# Altium project petroskey.PrjPcb
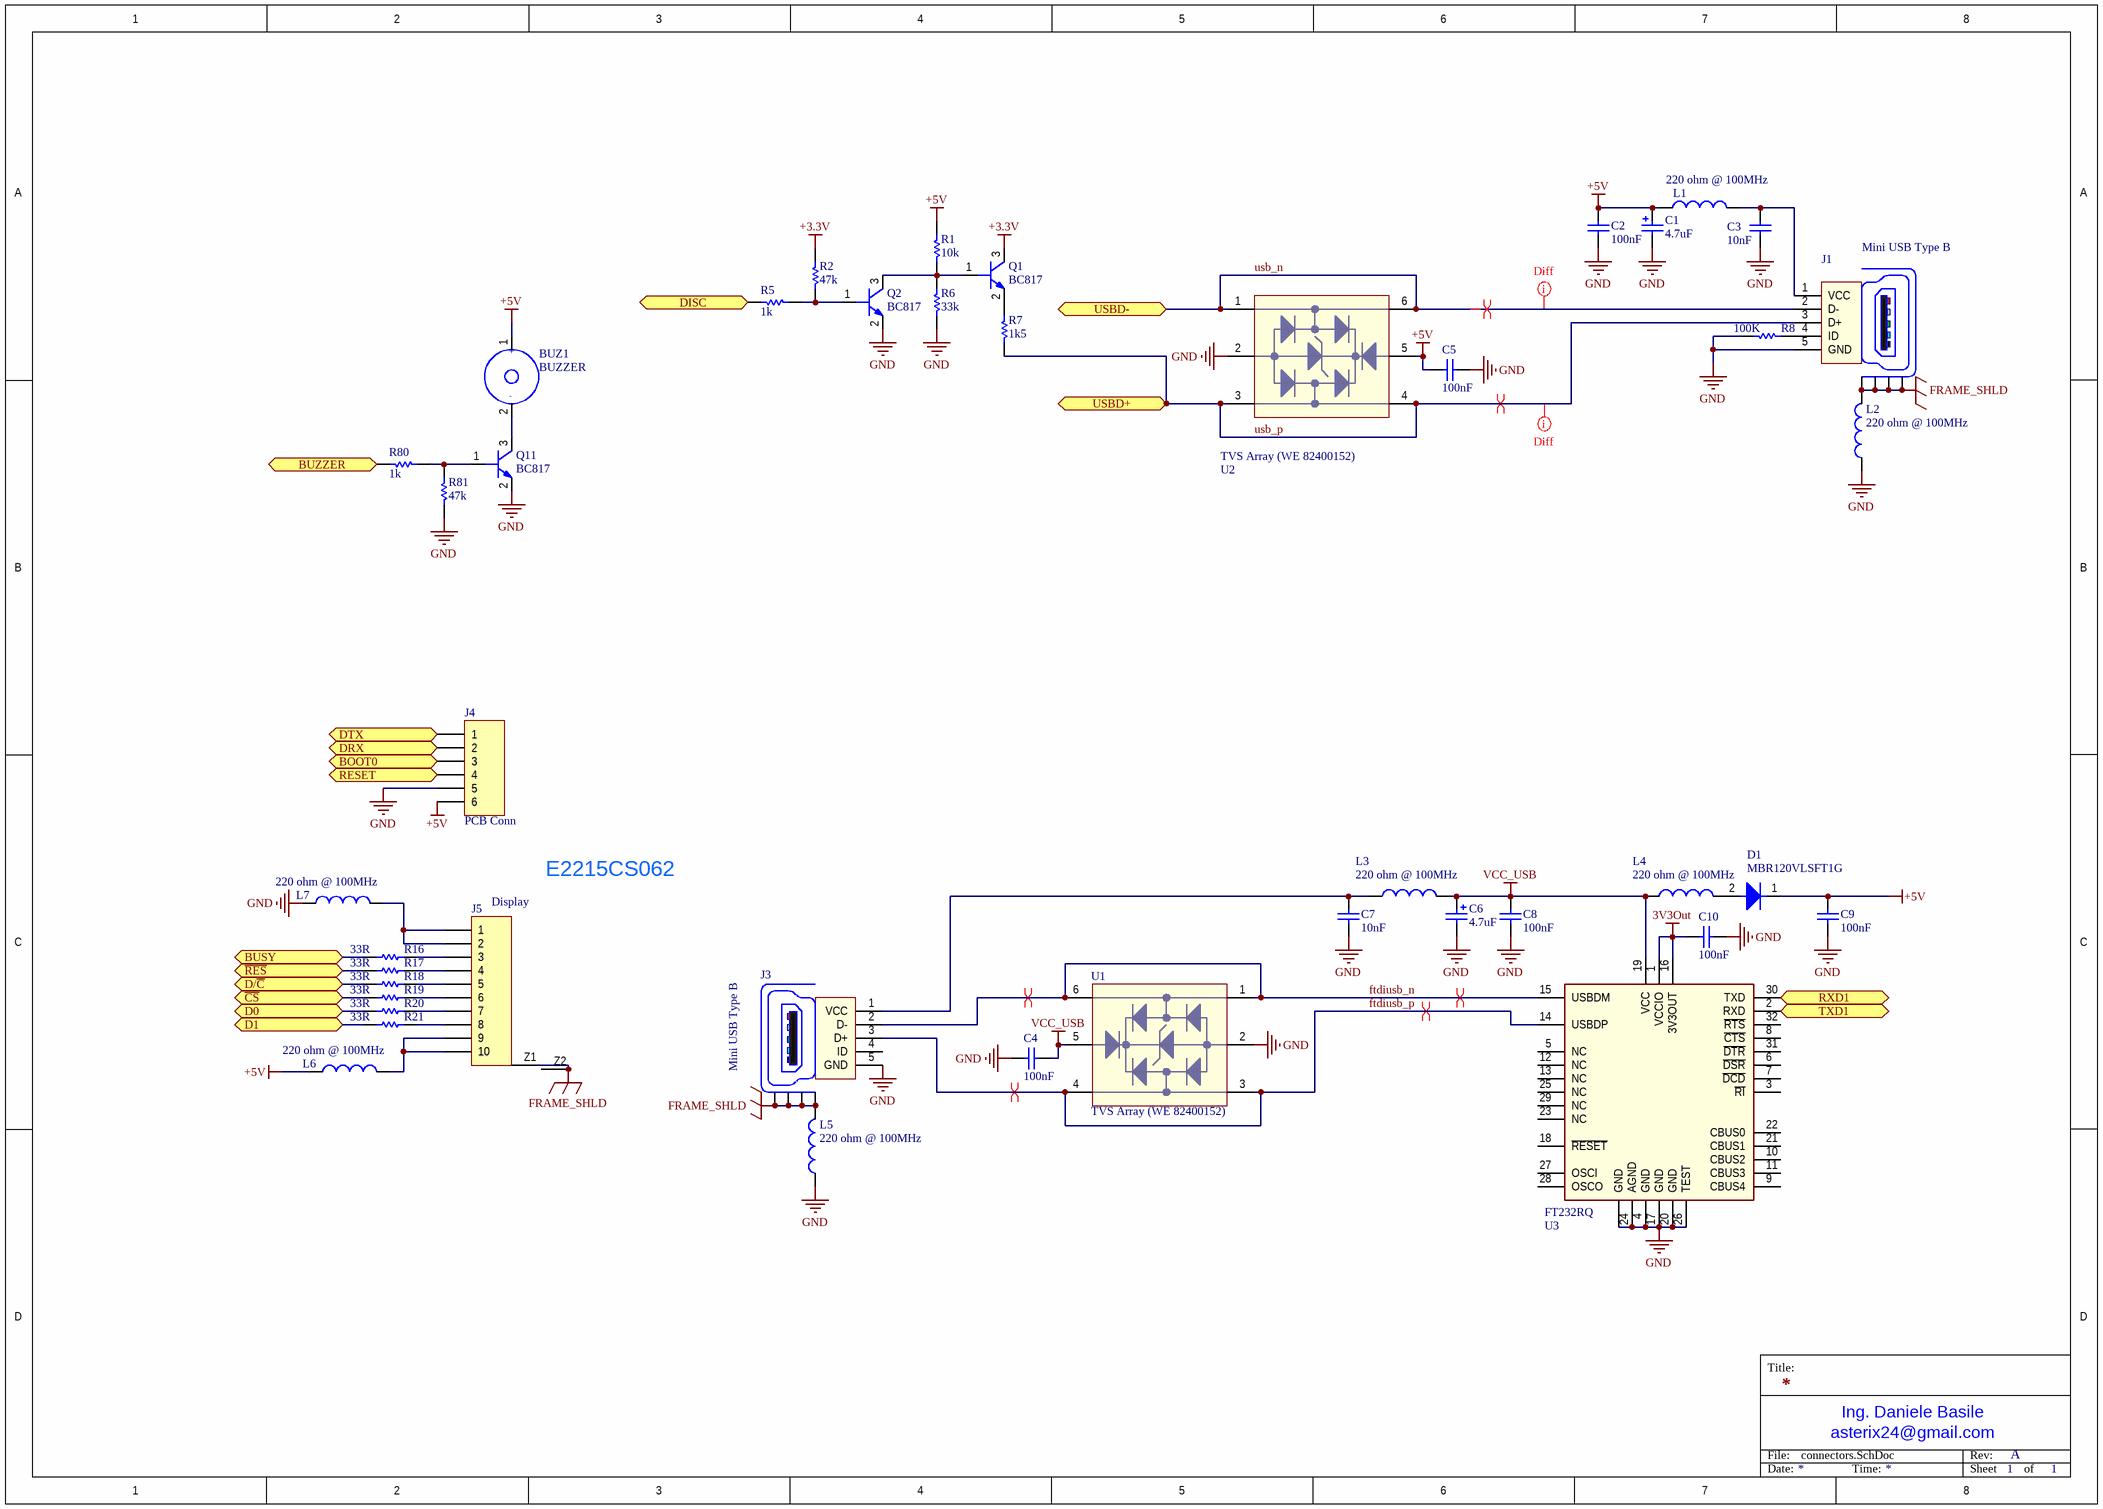
[diagram p0: connectors.SchDoc]
4 sheets, 381 parts. Net scope: flat (ports and power ports of the same name join across sheets).
Board file: petroskey.PcbDoc
Sheets:
  connectors.SchDoc
  cpu.SchDoc
  led.SchDoc
  keymap.SchDoc

## Sheet connectors.SchDoc
size A3; Organization: Develer s.r.l.; Address1: via Mugellese 1/A; Address2: 50019 Campi Bisenzio; Address3: Firenze; Address4: ITALY; Revision: A; SheetNumber: 1; SheetTotal: 1

### Parts
BUZ1  BUZZER  [buzzer_14mm_thd]
C1  4.7uF  [1206_[3216]]
C2  100nF  [0603_[1608]]
C3  10nF  [0603_[1608]]
C4  100nF  [0603_[1608]]
C5  100nF  [0603_[1608]]
C6  4.7uF  [1206_[3216]]
C7  10nF  [0603_[1608]]
C8  100nF  [0603_[1608]]
C9  100nF  [0603_[1608]]
C10  100nF  [0603_[1608]]
D1  MBR120VLSFT1G  [SOD-123]
J1  Mini USB Type B  [usb_typeB_mini_smd]
J3  Mini USB Type B  [usb_typeB_mini_smd]
J4  PCB Conn  [HEADER_1X6_2.54MM_THD]
J5  Display  [fcc-zif_10pin_0.5mm]
L1  220 ohm @ 100MHz  [0805_[2012]]
L2  220 ohm @ 100MHz  [0805_[2012]]
L3  220 ohm @ 100MHz  [0805_[2012]]
L4  220 ohm @ 100MHz  [0805_[2012]]
L5  220 ohm @ 100MHz  [0805_[2012]]
L6  220 ohm @ 100MHz  [0805_[2012]]
L7  220 ohm @ 100MHz  [0805_[2012]]
Q1  BC817  [SOT-23]
Q2  BC817  [SOT-23]
Q11  BC817  [SOT-23]
R1  10k  [0603_[1608]]
R2  47k  [0603_[1608]]
R5  1k  [0603_[1608]]
R6  33k  [0603_[1608]]
R7  1k5  [0603_[1608]]
R8  100K  [0603_[1608]]
R16  33R  [0603_[1608]]
R17  33R  [0603_[1608]]
R18  33R  [0603_[1608]]
R19  33R  [0603_[1608]]
R20  33R  [0603_[1608]]
R21  33R  [0603_[1608]]
R80  1k  [0603_[1608]]
R81  47k  [0603_[1608]]
U1  TVS Array (WE 82400152)  [SOT-563]
U2  TVS Array (WE 82400152)  [SOT-563]
U3  FT232RQ  [QFN-32]

### Ports
BOOT0, BUSY, BUZZER, D0, D1, D/~{C}, DISC, DRX, DTX, RESET, RXD1, TXD1, USBD+, USBD-, ~{CS}, ~{RES}

### Nets
3V3Out: C10.1 U3.1(VCCIO) U3.16(3V3OUT)
+3.3V: Q1.3(C) R2.1
+5V: BUZ1.1 C1.1 C2.1 C5.2 C9.2 D1.1(K) J4.6 L1.1 L6.1 R1.1 U2.5
FRAME_SHLD: J1.Z1(Shield) J1.Z2(Shield) J1.Z3(Shield) J1.Z4(Shield) J3.Z1(Shield) J3.Z2(Shield) J3.Z3(Shield) J3.Z4(Shield) J5.Z1 J5.Z2 L2.2 L5.2
GND: C1.2 C2.2 C3.2 C4.1 C5.1 C6.2 C7.2 C8.2 C9.1 C10.2 J1.5(GND) J3.5(GND) J4.5 L2.1 L5.1 L7.1 Q2.2(E) Q11.2(E) R6.2 R8.2 R81.2 U1.2 U2.2 U3.4(GND) U3.17(GND) U3.20(GND) U3.24(AGND) U3.26(TEST) U3.GND_PAD(GND)
VCC_USB: C4.2 C6.1 C8.1 L3.1 L4.2 U1.5 U3.19(VCC)
ftdiusb_n: J3.2(D-) U1.1 U1.6 U3.15(USBDM)
ftdiusb_p: J3.3(D+) U1.3 U1.4 U3.14(USBDP)
usb_n: J1.2(D-) U2.1 U2.6 ; port USBD-
usb_p: J1.3(D+) R7.2 U2.3 U2.4 ; port USBD+
NetBUZ1_2: BUZ1.2 Q11.3(C)
NetC3_1: C3.1 J1.1(VCC) L1.2
NetC7_1: C7.1 J3.1(VCC) L3.2
NetD1_2: D1.2(A) L4.1
NetJ1_4: J1.4(ID) R8.1
NetJ4_1: J4.1 ; port DTX
NetJ4_2: J4.2 ; port DRX
NetJ4_3: J4.3 ; port BOOT0
NetJ4_4: J4.4 ; port RESET
NetJ5_1: J5.1 J5.2 L7.2
NetJ5_3: J5.3 R16.1
NetJ5_4: J5.4 R17.1
NetJ5_5: J5.5 R18.1
NetJ5_6: J5.6 R19.1
NetJ5_7: J5.7 R20.1
NetJ5_8: J5.8 R21.1
NetJ5_9: J5.9 J5.10 L6.2
NetQ1_1: Q1.1(B) Q2.3(C) R1.2 R6.1
NetQ1_2: Q1.2(E) R7.1
NetQ2_1: Q2.1(B) R2.2 R5.1
NetQ11_1: Q11.1(B) R80.1 R81.1
NetR5_2: R5.2 ; port DISC
NetR12_2: U3.2(RXD) ; port TXD1
NetR13_2: U3.30(TXD) ; port RXD1
NetR16_2: R16.2 ; port BUSY
NetR17_2: R17.2 ; port ~{RES}
NetR18_2: R18.2 ; port D/~{C}
NetR19_2: R19.2 ; port ~{CS}
NetR20_2: R20.2 ; port D0
NetR21_2: R21.2 ; port D1
NetR80_2: R80.2 ; port BUZZER

Not connected (* = marked no-connect by the designer): J3 4(ID); U3 3(~{RI}) 5(NC) 6(~{DSR}) 7(~{DCD}) 8(~{CTS}) 9(CBUS4) 10(CBUS2) 11(CBUS3) 12(NC) 13(NC) 18(~{RESET}) 21(CBUS1) 22(CBUS0) 23(NC) 25(NC) 27(OSCI) 28(OSCO) 29(NC) 31(~{DTR}) 32(~{RTS})

### Layout directives
net class usb_diff: usb_n, usb_p
differential pair: ftdiusb_n, ftdiusb_p, usb_n, usb_p

### Notes on the sheet
- (near J5) E2215CS062
- Title:
- File:
- asterix24@gmail.com
- Ing. Daniele Basile
- Rev:
- Date:
- Time:
- Sheet
- of
- (in symbol BUZZER) +; -

### Library data of the parts
C1 = Cap Pol1: Ceramic X7R 16V; Value: 10uF; Published: 8-Jun-2000; Revision: July-2002: Re-released for DXP Platform.; Publisher: Altium Limited
C2 C8-C10 = Cap: Ceramic X7R 50V; Value: 10nF; Published: 8-Jun-2000; Revision: July-2002: Re-released for DXP Platform.; Publisher: Altium Limited
C3 C7 = Cap: Ceramic X7R 50V; Published: 8-Jun-2000; Revision: July-2002: Re-released for DXP Platform.; Publisher: Altium Limited; Value: 10nF
C4 C5 = Cap: Ceramic X7R 50V; Value: 100pF; Published: 8-Jun-2000; LatestRevisionDate: 17-Jul-2002; LatestRevisionNote: Re-released for DXP Platform.; PackageReference: RAD-0.3; Publisher: Altium Limited; PackageDescription: Radial Cap, Thru-Hole; 2 Leads; 0.3 in Pin Spacing
C6 = Cap Pol1: Ceramic X5R 25V; Value: 10uF; Published: 8-Jun-2000; Revision: July-2002: Re-released for DXP Platform.; Publisher: Altium Limited
D1 = Diode: Diode Schottky  low Vf, If 1A (PMEG3010ER; MBRX120LF)
J1 = USB_Con_Type_B_mini_SMT: Mini USB SMT Type B 5 Contacts; Manufacturer: Würth Elektronik eiSos GmbH; partNo: 65100516121; ComponentLink1 Description: Manufacturer; ComponentLink2 Description: Datasheet; NoPins: 5; ComponentLink1URL: http://www.we-online.de; ComponentLink2URL: http://katalog.we-online.de/em/datasheet/65100516121.pdf; Created by: Karrer Zheng; Created Date: 10/10/2014
J3 = USB_Con_Type_B_mini_SMT: Mini USB SMT Type B 5 Contacts (WE 65100516121); Manufacturer: Würth Elektronik eiSos GmbH; ComponentLink1 Description: Manufacturer; ComponentLink2 Description: Datasheet; NoPins: 5; ComponentLink1URL: http://www.we-online.de; ComponentLink2URL: http://katalog.we-online.de/em/datasheet/65100516121.pdf; Created by: Karrer Zheng; Created Date: 10/10/2014; partNo: 65100516121
J4 = Header 6: Pin Header, 1x6, 2.54mm.; LatestRevisionDate: 17-Jul-2002; LatestRevisionNote: Re-released for DXP Platform.; Publisher: Altium Limited
J5 = Header 10: LatestRevisionDate: 17-Jul-2002; LatestRevisionNote: Re-released for DXP Platform.; Publisher: Altium Limited
L1-L7 = Inductor: WE 742792022
Q1 Q2 Q11 = BC817: BJT NPN
R1 R2 R6 R7 R16-R21 R81 = Res1: Resistor; Value: 1K; Published: 8-Jun-2000; Revision: July-2002: Re-released for DXP Platform.; Publisher: Altium Limited
R5 R80 = Res1: Resistor; Published: 8-Jun-2000; Revision: July-2002: Re-released for DXP Platform.; Publisher: Altium Limited; Value: 1K
R8 = Resistor_ST: Resistor; Value: 10K
U1 U2 = TVS_Diode_Array
U3 = FT232RQ: Serial TTL 232 <-> USB (QFN-32)

## Sheet cpu.SchDoc
size A3; Organization: Develer s.r.l.; Address1: via Mugellese 1/A; Address2: 50019 Campi Bisenzio; Address3: Firenze; Address4: ITALY; Revision: A; SheetNumber: 1; SheetTotal: 1
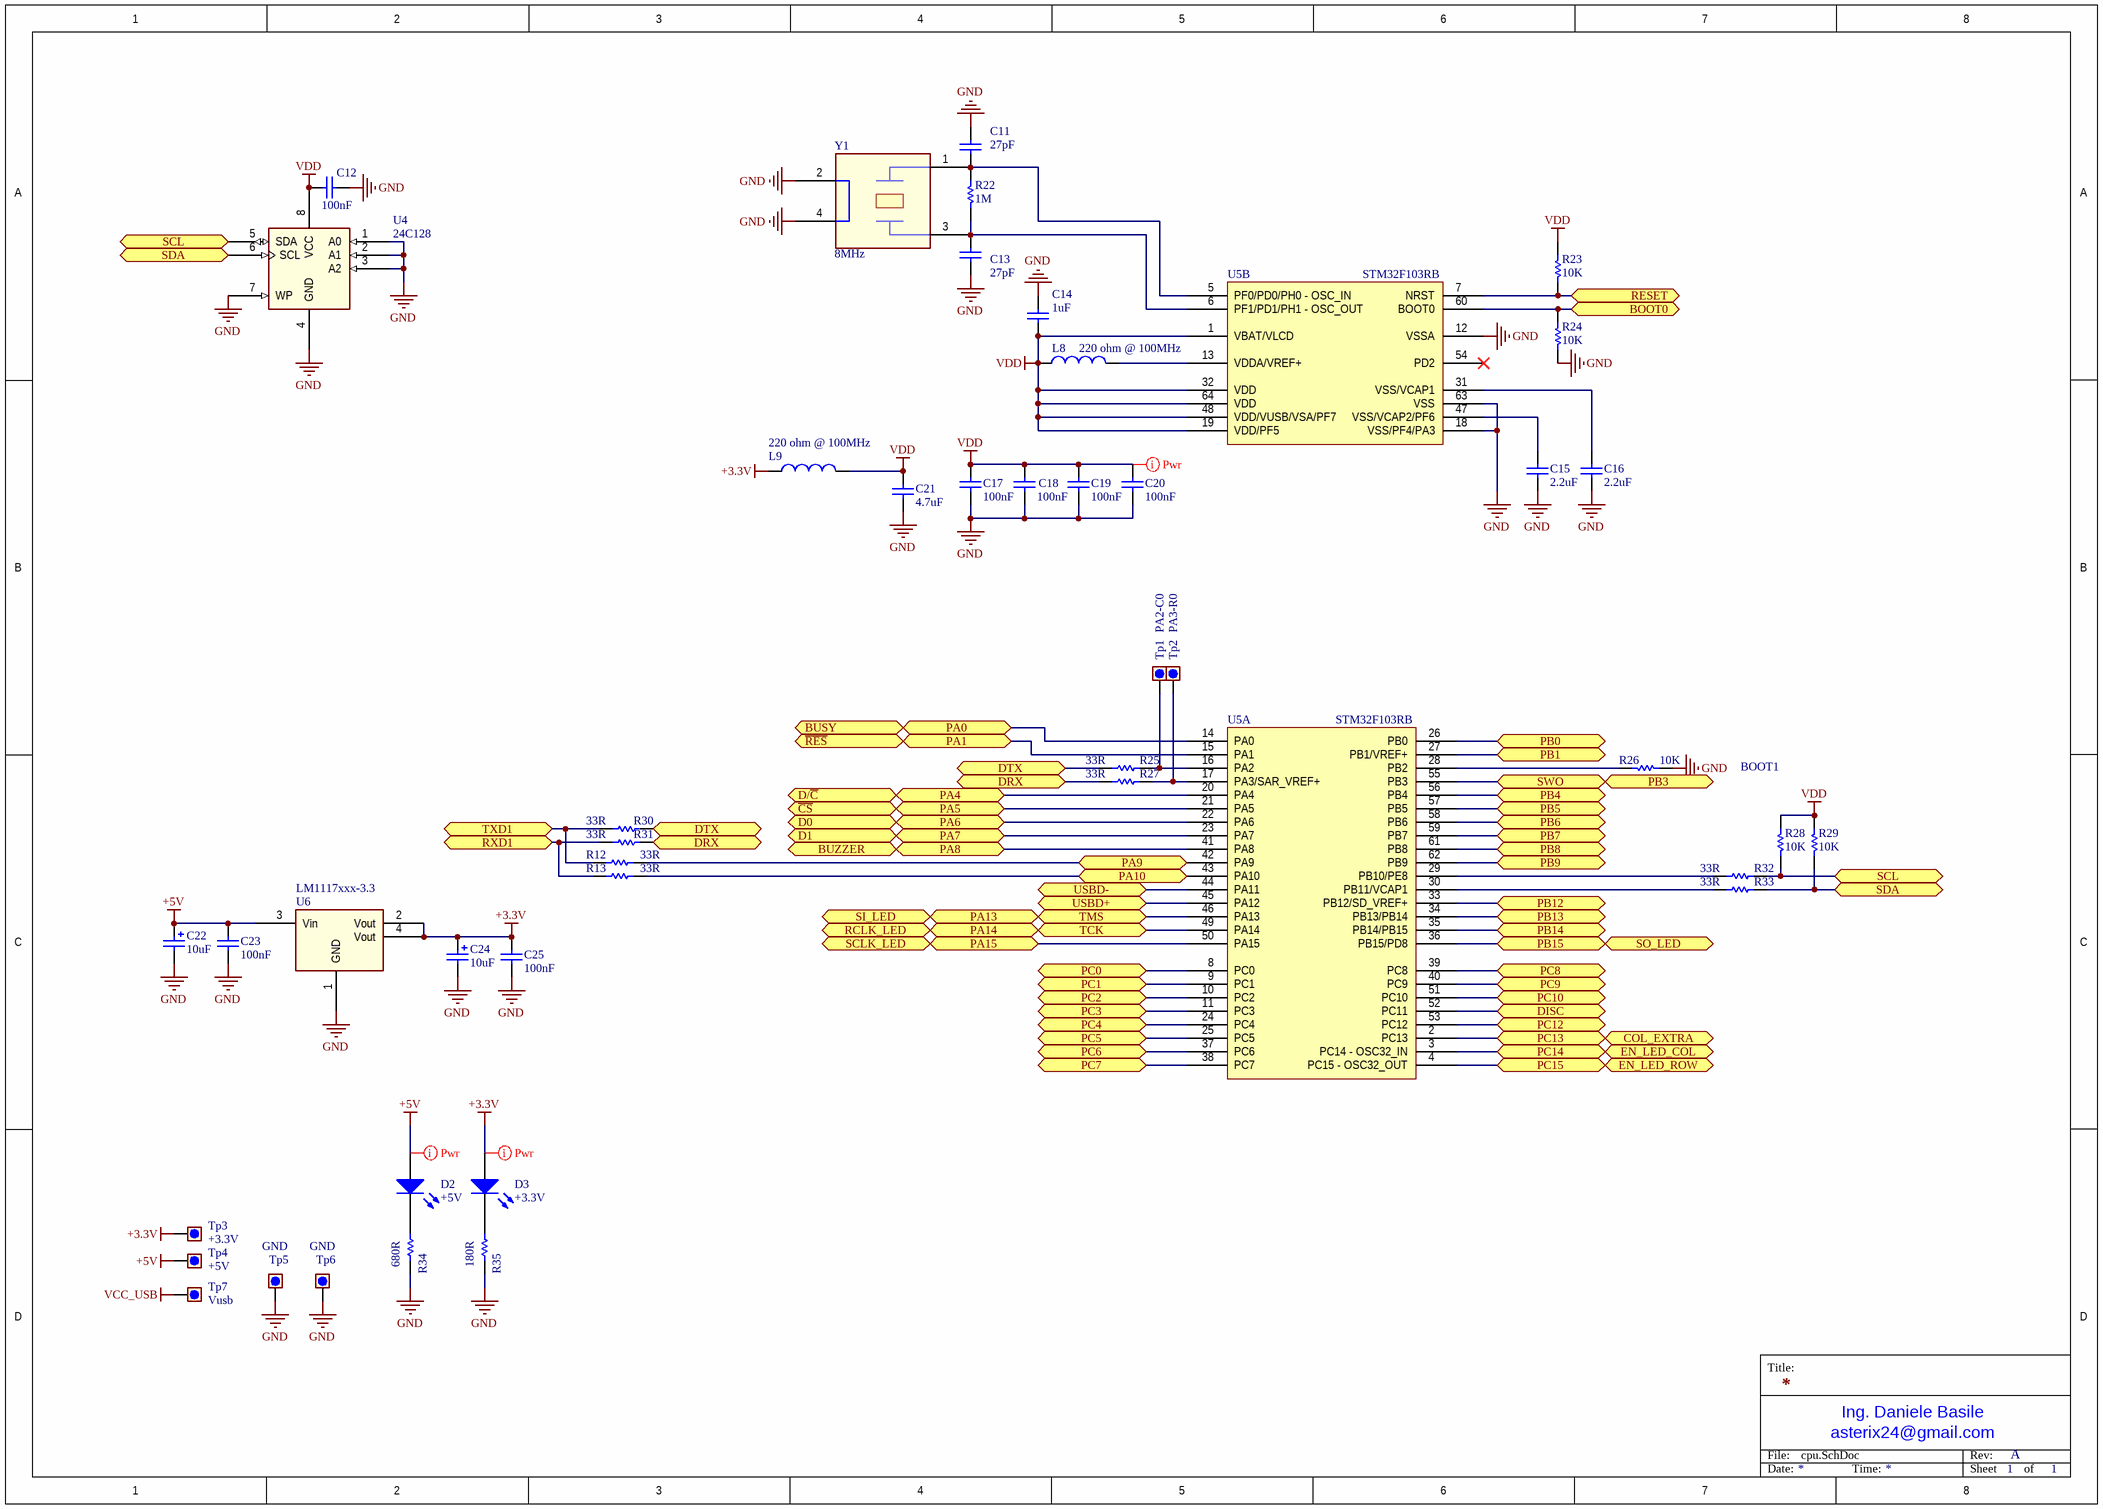
[diagram p1: cpu.SchDoc]

### Parts
C11  27pF  [0603_[1608]]
C12  100nF  [0603_[1608]]
C13  27pF  [0603_[1608]]
C14  1uF  [0603_[1608]]
C15  2.2uF  [0603_[1608]]
C16  2.2uF  [0603_[1608]]
C17  100nF  [0603_[1608]]
C18  100nF  [0603_[1608]]
C19  100nF  [0603_[1608]]
C20  100nF  [0603_[1608]]
C21  4.7uF  [0603_[1608]]
C22  10uF  [1206_[3216]]
C23  100nF  [0603_[1608]]
C24  10uF  [1206_[3216]]
C25  100nF  [0603_[1608]]
D2  +5V  [0603_[1608]_K2-A1_LED]
D3  +3.3V  [0603_[1608]_K2-A1_LED]
L8  220 ohm @ 100MHz  [0805_[2012]]
L9  220 ohm @ 100MHz  [0805_[2012]]
R12  33R  [0603_[1608]]
R13  33R  [0603_[1608]]
R22  1M  [0603_[1608]]
R23  10K  [0603_[1608]]
R24  10K  [0603_[1608]]
R25  33R  [0603_[1608]]
R26  10K  [0603_[1608]]
R27  33R  [0603_[1608]]
R28  10K  [0603_[1608]]
R29  10K  [0603_[1608]]
R30  33R  [0603_[1608]]
R31  33R  [0603_[1608]]
R32  33R  [0603_[1608]]
R33  33R  [0603_[1608]]
R34  680R  [0603_[1608]]
R35  180R  [0603_[1608]]
Tp1  PA2-C0  [TEST_POINT_THD_D1.8MM]  (no BOM)
Tp2  PA3-R0  [TEST_POINT_THD_D1.8MM]  (no BOM)
Tp3  +3.3V  [TEST_POINT_THD_D1.8MM]  (no BOM)
Tp4  +5V  [TEST_POINT_THD_D1.8MM]  (no BOM)
Tp5  GND  [TEST_POINT_THD_D1.8MM]  (no BOM)
Tp6  GND  [TEST_POINT_THD_D1.8MM]  (no BOM)
Tp7  Vusb  [TEST_POINT_THD_D1.8MM]  (no BOM)
U4  24C128  [SOIC8]
U5  STM32F103RB  [TSQFP50P1200X1200X160-64N]  (parts A,B of 2)
U6  LM1117xxx-3.3  [SOT-223]
Y1  8MHz  [CRYSTAL_3.2X2.5MM_4P_SMD]

### Ports
BOOT0, BUSY, BUZZER, COL_EXTRA, D0, D1, D/~{C}, DISC, DRX, DTX, EN_LED_COL, EN_LED_ROW, PA0, PA1, PA4, PA5, PA6, PA7, PA8, PA9, PA10, PA13, PA14, PA15, PB0, PB1, PB3, PB4, PB5, PB6, PB7, PB8, PB9, PB12, PB13, PB14, PB15, PC0, PC1, PC2, PC3, PC4, PC5, PC6, PC7, PC8, PC9, PC10, PC12, PC13, PC14, PC15, RCLK_LED, RESET, RXD1, SCL, SCLK_LED, SDA, SI_LED, SO_LED, SWO, TCK, TMS, TXD1, USBD+, USBD-, ~{CS}, ~{RES}

### Nets
+3.3V: C24.1 C25.2 D3.1(A) L9.1 Tp3.1 U6.2(Vout) U6.4(Vout)
+5V: C22.1 C23.2 D2.1(A) Tp4.1 U6.3(Vin)
GND: C11.2 C12.1 C13.2 C14.2 C15.1 C16.1 C17.2 C18.2 C19.2 C20.2 C21.1 C22.2 C23.1 C24.2 C25.1 R24.1 R26.2 R34.1 R35.1 Tp5.1 Tp6.1 U4.1(A0) U4.2(A1) U4.3(A2) U4.4(GND) U4.7(WP) U5.12(VSSA) U5.18(VSS/PF4/PA3) U5.63(VSS) U6.1(GND) Y1.2 Y1.4
VCC_USB: Tp7.1
VDD: C12.2 C14.1 C17.1 C18.1 C19.1 C20.1 C21.2 L8.1 L9.2 R23.1 R28.2 R29.2 U4.8(VCC) U5.1(VBAT/VLCD) U5.19(VDD/PF5) U5.32(VDD) U5.48(VDD/VUSB/VSA/PF7) U5.64(VDD)
usb_n: U5.44(PA11) ; port USBD-
usb_p: U5.45(PA12) ; port USBD+
NetC11_1: C11.1 R22.2 U5.5(PF0/PD0/PH0_-_OSC_IN) Y1.1
NetC13_1: C13.1 R22.1 U5.6(PF1/PD1/PH1_-_OSC_OUT) Y1.3
NetC15_2: C15.2 U5.47(VSS/VCAP2/PF6)
NetC16_2: C16.2 U5.31(VSS/VCAP1)
NetD2_2: D2.2(K) R34.2
NetD3_2: D3.2(K) R35.2
NetJ4_1: R25.2 R30.1 ; port DTX
NetJ4_2: R27.2 R31.1 ; port DRX
NetJ4_3: R24.2 U5.60(BOOT0) ; port BOOT0
NetJ4_4: R23.2 U5.7(NRST) ; port RESET
NetL8_2: L8.2 U5.13(VDDA/VREF+)
NetR5_2: U5.52(PC11) ; port DISC
NetR12_1: R12.1 U5.42(PA9) ; port PA9
NetR12_2: R12.2 R30.2 ; port TXD1
NetR13_1: R13.1 U5.43(PA10) ; port PA10
NetR13_2: R13.2 R31.2 ; port RXD1
NetR16_2: U5.14(PA0) ; port PA0, port BUSY
NetR17_2: U5.15(PA1) ; port PA1, port ~{RES}
NetR18_2: U5.20(PA4) ; port PA4, port D/~{C}
NetR19_2: U5.21(PA5) ; port PA5, port ~{CS}
NetR20_2: U5.22(PA6) ; port PA6, port D0
NetR21_2: U5.23(PA7) ; port PA7, port D1
NetR25_1: R25.1 Tp1.1 U5.16(PA2)
NetR26_1: R26.1 U5.28(PB2)
NetR27_1: R27.1 Tp2.1 U5.17(PA3/SAR_VREF+)
NetR28_1: R28.1 R32.1 U4.5(SDA) ; port SCL
NetR29_1: R29.1 R33.1 U4.6(SCL) ; port SDA
NetR32_2: R32.2 U5.29(PB10/PE8)
NetR33_2: R33.2 U5.30(PB11/VCAP1)
NetR36_2: U5.26(PB0) ; port PB0
NetR37_2: U5.27(PB1/VREF+) ; port PB1
NetR38_2: U5.55(PB3) ; port SWO, port PB3
NetR39_2: U5.56(PB4) ; port PB4
NetR40_2: U5.57(PB5) ; port PB5
NetR41_2: U5.58(PB6) ; port PB6
NetR42_2: U5.59(PB7) ; port PB7
NetR43_2: U5.61(PB8) ; port PB8
NetR44_2: U5.62(PB9) ; port PB9
NetR45_2: U5.33(PB12/SD_VREF+) ; port PB12
NetR46_2: U5.34(PB13/PB14) ; port PB13
NetR47_2: U5.35(PB14/PB15) ; port PB14
NetR48_2: U5.8(PC0) ; port PC0
NetR49_2: U5.9(PC1) ; port PC1
NetR50_2: U5.10(PC2) ; port PC2
NetR51_2: U5.11(PC3) ; port PC3
NetR52_2: U5.24(PC4) ; port PC4
NetR53_2: U5.25(PC5) ; port PC5
NetR54_2: U5.37(PC6) ; port PC6
NetR55_2: U5.38(PC7) ; port PC7
NetR56_2: U5.39(PC8) ; port PC8
NetR57_2: U5.40(PC9) ; port PC9
NetR58_2: U5.51(PC10) ; port PC10
NetR59_2: U5.53(PC12) ; port PC12
NetR76_2: U5.3(PC14_-_OSC32_IN) ; port PC14, port EN_LED_COL
NetR77_2: U5.4(PC15_-_OSC32_OUT) ; port PC15, port EN_LED_ROW
NetR80_2: U5.41(PA8) ; port PA8, port BUZZER
NetR82_1: U5.2(PC13) ; port PC13, port COL_EXTRA
NetU5_36: U5.36(PB15/PD8) ; port PB15, port SO_LED
NetU5_46: U5.46(PA13) ; port TMS, port PA13, port SI_LED
NetU5_49: U5.49(PA14) ; port TCK, port PA14, port RCLK_LED
NetU5_50: U5.50(PA15) ; port PA15, port SCLK_LED

Not connected (* = marked no-connect by the designer): U5 54(PD2)*

### Layout directives
net class Power: +3.3V, +5V, VDD

### Notes on the sheet
- BOOT1
- Title:
- File:
- asterix24@gmail.com
- Ing. Daniele Basile
- Rev:
- Date:
- Time:
- Sheet
- of

### Library data of the parts
C11 C13 = Cap: Ceramic NP0 +/- 0.1; Value: 10nF; Published: 8-Jun-2000; Revision: July-2002: Re-released for DXP Platform.; Publisher: Altium Limited
C12 C17-C20 = Cap: Ceramic X7R 50V; Value: 10nF; Published: 8-Jun-2000; Revision: July-2002: Re-released for DXP Platform.; Publisher: Altium Limited
C14 C21 = Cap: Ceramic X7R 16V; Value: 10nF; Published: 8-Jun-2000; Revision: July-2002: Re-released for DXP Platform.; Publisher: Altium Limited
C15 C16 = Cap: Ceramic 6.3V X7R; Value: 10nF; Published: 8-Jun-2000; Revision: July-2002: Re-released for DXP Platform.; Publisher: Altium Limited
C22 C24 = Cap Pol1: Ceramic X5R 25V; Published: 8-Jun-2000; Revision: July-2002: Re-released for DXP Platform.; Publisher: Altium Limited; Value: 10uF
C23 C25 = Cap: Ceramic X7R 50V; Value: 100pF; Published: 8-Jun-2000; LatestRevisionDate: 17-Jul-2002; LatestRevisionNote: Re-released for DXP Platform.; PackageReference: RAD-0.3; Publisher: Altium Limited; PackageDescription: Radial Cap, Thru-Hole; 2 Leads; 0.3 in Pin Spacing
D2 D3 = LED0: LED Green; Published: 8-Jun-2000; LatestRevisionDate: 08-Jul-2005; LatestRevisionNote: Mech Layer 1 removed.; PackageReference: LED-0; Publisher: Altium Limited; PackageDescription: LED; 2 Leads
L8 = Inductor: Value: 100uH; Published: 8-Jun-2000; Revision: July-2002: Re-released for DXP Platform.; Publisher: Altium Limited
L9 = Inductor: WE 742792022
R12 R13 R22-R33 = Res1: Resistor; Value: 1K; Published: 8-Jun-2000; Revision: July-2002: Re-released for DXP Platform.; Publisher: Altium Limited
R34 R35 = Res1: Resistor; Revision: July-2002: Re-released for DXP Platform.
Tp1-Tp7 = Test_point: Test point
U4 = EEPROM-SOIC8: EEPROM
U6 = LM1117-FIXED-OUT: LM1117 LDO Fixed output
Y1 = CRYSTAL-4p

## Sheet led.SchDoc
size A3; Organization: Develer s.r.l.; Address1: via Mugellese 1/A; Address2: 50019 Campi Bisenzio; Address3: Firenze; Address4: ITALY; Revision: A; SheetNumber: 1; SheetTotal: 1
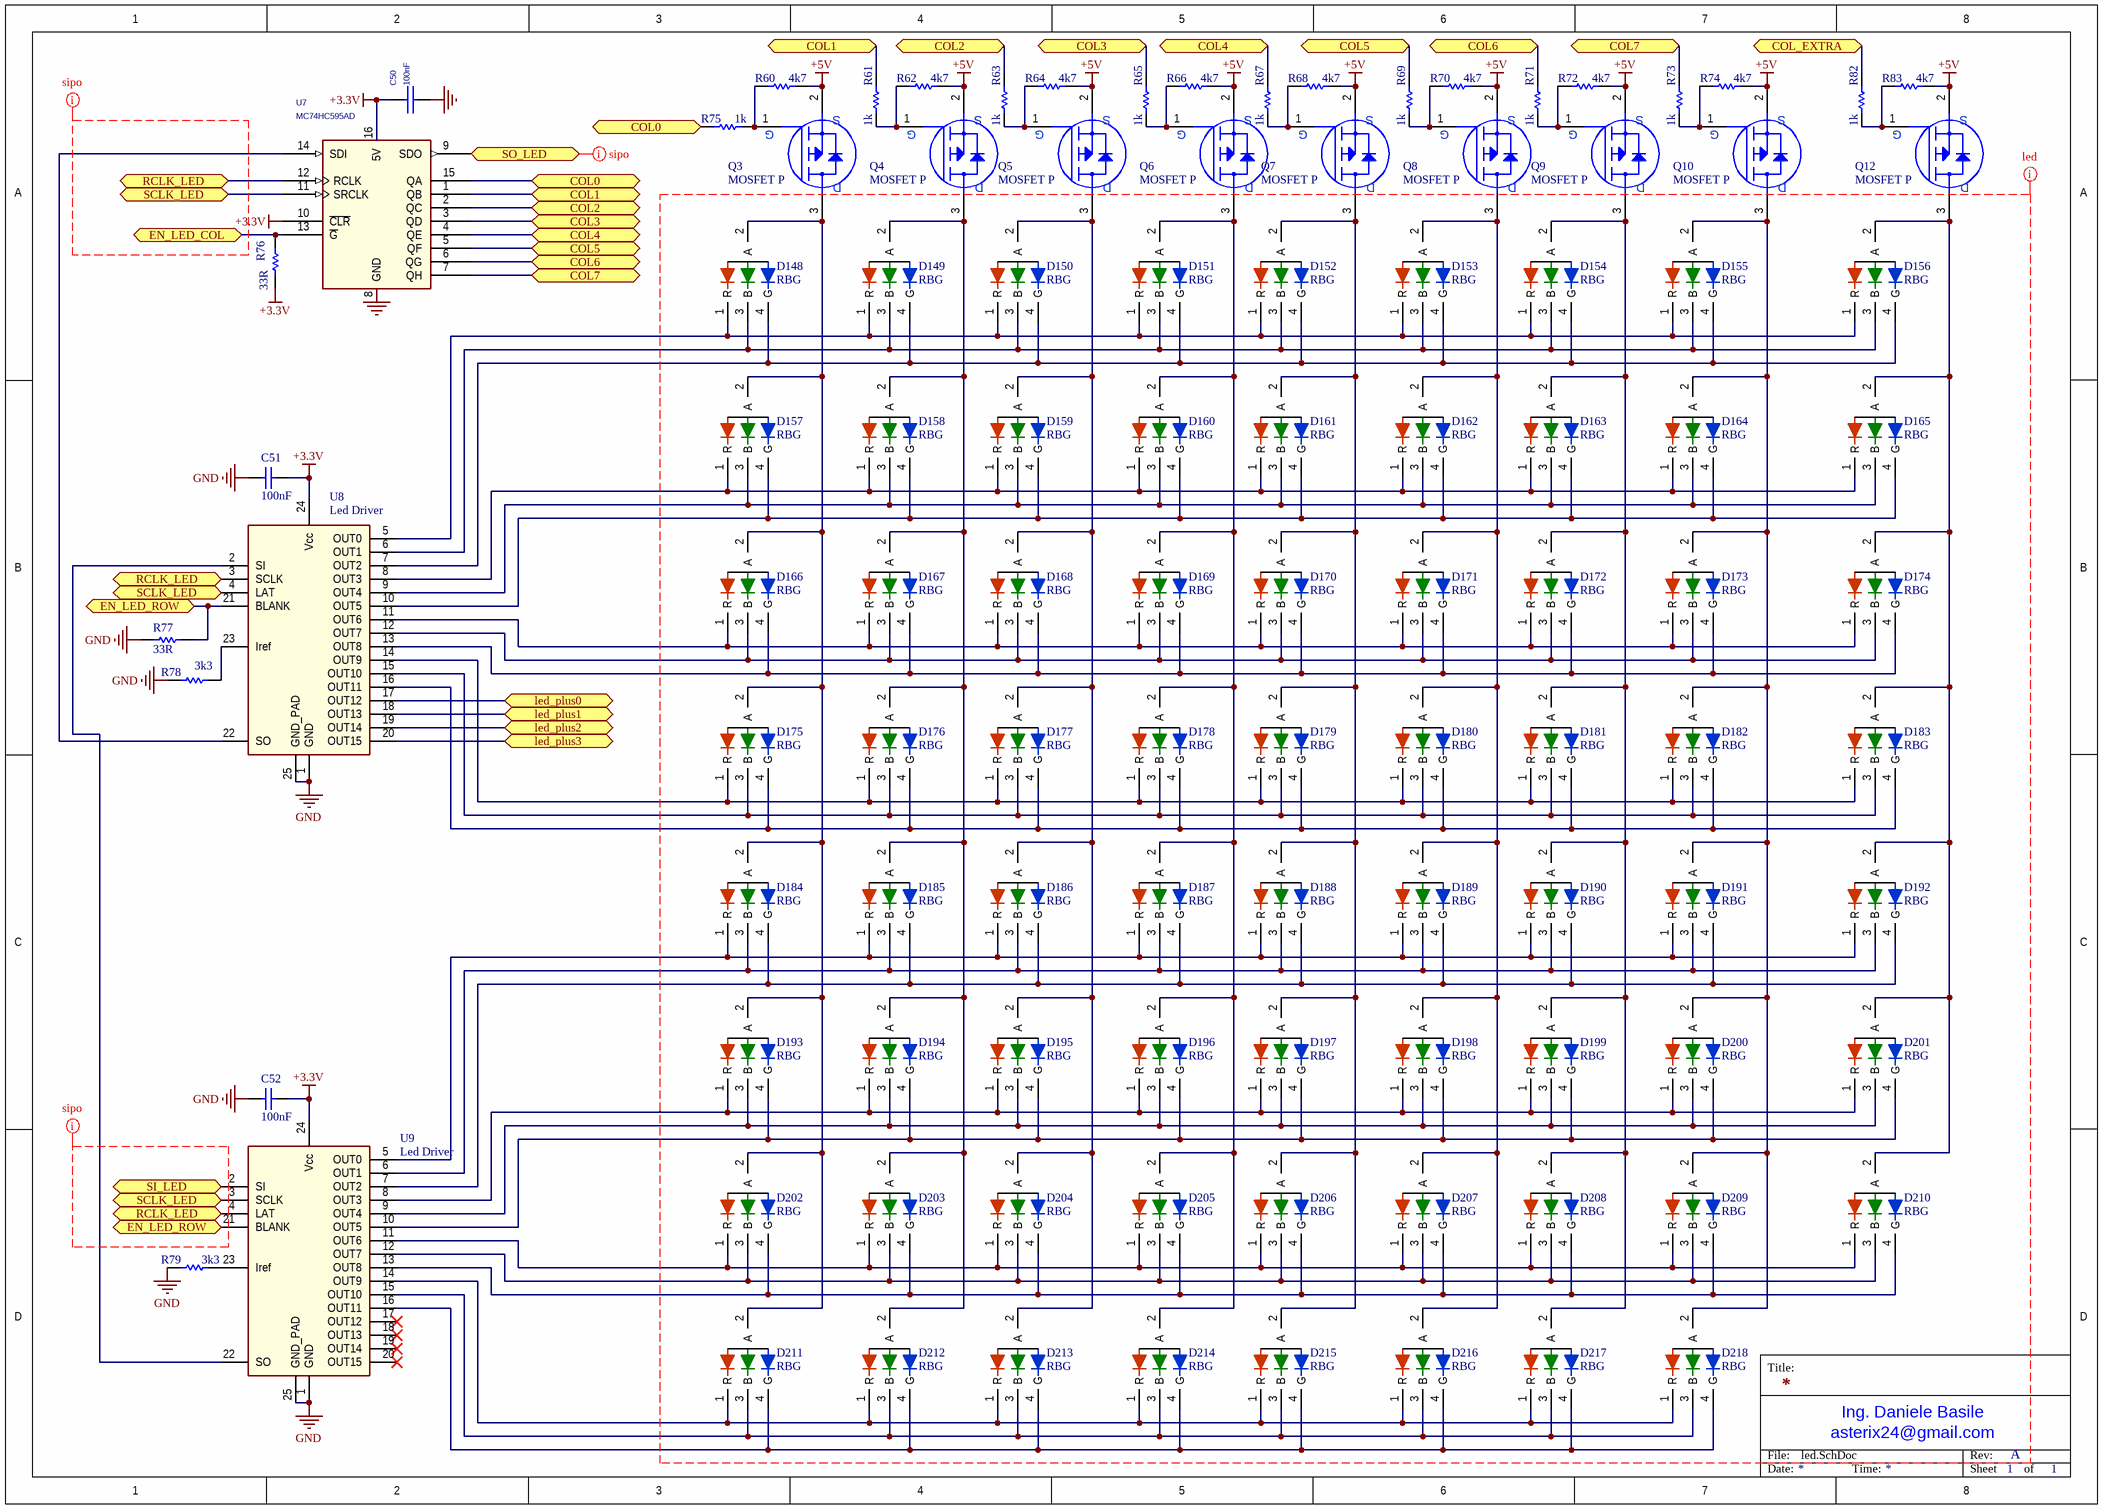
[diagram p2: led.SchDoc]

### Parts
C50  100nF  [0603_[1608]]
C51  100nF  [0603_[1608]]
C52  100nF  [0603_[1608]]
D148  RBG
D149  RBG  [led_3.2x2.8mm_4p_smd]
D150  RBG  [led_3.2x2.8mm_4p_smd]
D151  RBG  [led_3.2x2.8mm_4p_smd]
D152  RBG
D153  RBG  [led_3.2x2.8mm_4p_smd]
D154  RBG
D155  RBG
D156  RBG  [R3_RGB_LED_THD]
D157  RBG  [R3_RGB_LED_THD]
D158  RBG  [R3_RGB_LED_THD]
D159  RBG  [R3_RGB_LED_THD]
D160  RBG
D161  RBG
D162  RBG
D163  RBG
D164  RBG  [led_3.2x2.8mm_4p_smd]
D165  RBG  [R3_RGB_LED_THD]
D166  RBG  [R3_RGB_LED_THD]
D167  RBG  [R3_RGB_LED_THD]
D168  RBG  [R3_RGB_LED_THD]
D169  RBG
D170  RBG
D171  RBG
D172  RBG
D173  RBG  [R3_RGB_LED_THD]
D174  RBG  [R3_RGB_LED_THD]
D175  RBG  [R3_RGB_LED_THD]
D176  RBG  [R3_RGB_LED_THD]
D177  RBG
D178  RBG
D179  RBG
D180  RBG
D181  RBG  [R3_RGB_LED_THD]
D182  RBG  [R3_RGB_LED_THD]
D183  RBG  [R3_RGB_LED_THD]
D184  RBG  [R3_RGB_LED_THD]
D185  RBG
D186  RBG
D187  RBG
D188  RBG
D189  RBG  [R3_RGB_LED_THD]
D190  RBG  [R3_RGB_LED_THD]
D191  RBG  [R3_RGB_LED_THD]
D192  RBG  [R3_RGB_LED_THD]
D193  RBG
D194  RBG
D195  RBG
D196  RBG
D197  RBG  [R3_RGB_LED_THD]
D198  RBG  [R3_RGB_LED_THD]
D199  RBG  [R3_RGB_LED_THD]
D200  RBG  [led_3.2x2.8mm_4p_smd]
D201  RBG  [R3_RGB_LED_THD]
D202  RBG
D203  RBG
D204  RBG
D205  RBG
D206  RBG  [R3_RGB_LED_THD]
D207  RBG  [R3_RGB_LED_THD]
D208  RBG  [R3_RGB_LED_THD]
D209  RBG  [R3_RGB_LED_THD]
D210  RBG
D211  RBG
D212  RBG  [R3_RGB_LED_THD]
D213  RBG  [R3_RGB_LED_THD]
D214  RBG  [R3_RGB_LED_THD]
D215  RBG  [R3_RGB_LED_THD]
D216  RBG  [R3_RGB_LED_THD]
D217  RBG  [R3_RGB_LED_THD]
D218  RBG  [R3_RGB_LED_THD]
Q3  MOSFET P  [SOT-23]
Q4  MOSFET P  [SOT-23]
Q5  MOSFET P  [SOT-23]
Q6  MOSFET P  [SOT-23]
Q7  MOSFET P  [SOT-23]
Q8  MOSFET P  [SOT-23]
Q9  MOSFET P  [SOT-23]
Q10  MOSFET P  [SOT-23]
Q12  MOSFET P  [SOT-23]
R60  4k7  [0603_[1608]]
R61  1k  [0603_[1608]]
R62  4k7  [0603_[1608]]
R63  1k  [0603_[1608]]
R64  4k7  [0603_[1608]]
R65  1k  [0603_[1608]]
R66  4k7  [0603_[1608]]
R67  1k  [0603_[1608]]
R68  4k7  [0603_[1608]]
R69  1k  [0603_[1608]]
R70  4k7  [0603_[1608]]
R71  1k  [0603_[1608]]
R72  4k7  [0603_[1608]]
R73  1k  [0603_[1608]]
R74  4k7  [0603_[1608]]
R75  1k  [0603_[1608]]
R76  33R  [0603_[1608]]
R77  33R  [0603_[1608]]
R78  3k3  [0805_[2012]]
R79  3k3  [0805_[2012]]
R82  1k  [0603_[1608]]
R83  4k7  [0603_[1608]]
U7  MC74HC595AD  [SOIC16]
U8  Led Driver  [TSOP65P640X120_HS-25N]
U9  Led Driver  [TSOP65P640X120_HS-25N]

### Ports
COL0, COL1, COL2, COL3, COL4, COL5, COL6, COL7, COL_EXTRA, EN_LED_COL, EN_LED_ROW, led_plus0, led_plus1, led_plus2, led_plus3, RCLK_LED, SCLK_LED, SI_LED, SO_LED

### Nets
+3.3V: C50.1 C51.2 C52.2 R76.1 U7.10(~{CLR}) U7.16(5V) U8.24(Vcc) U9.24(Vcc)  [also labelled 5V]
+5V: Q3.2(S) Q4.2(S) Q5.2(S) Q6.2(S) Q7.2(S) Q8.2(S) Q9.2(S) Q10.2(S) Q12.2(S) R60.1 R62.1 R64.1 R66.1 R68.1 R70.1 R72.1 R74.1 R83.1
GND: C50.2 C51.1 C52.1 R77.1 R78.1 R79.1 U7.8(GND) U8.1(GND) U8.25(GND_PAD) U9.1(GND) U9.25(GND_PAD)
NetD148_1: D148.1(R) D149.1(R) D150.1(R) D151.1(R) D152.1(R) D153.1(R) D154.1(R) D155.1(R) D156.1(R) U8.5(OUT0)
NetD148_2: D148.2(A) D157.2(A) D166.2(A) D175.2(A) D184.2(A) D193.2(A) D202.2(A) D211.2(A) Q3.3(D)
NetD148_3: D148.3(B) D149.3(B) D150.3(B) D151.3(B) D152.3(B) D153.3(B) D154.3(B) D155.3(B) D156.3(B) U8.6(OUT1)
NetD148_4: D148.4(G) D149.4(G) D150.4(G) D151.4(G) D152.4(G) D153.4(G) D154.4(G) D155.4(G) D156.4(G) U8.7(OUT2)
NetD149_2: D149.2(A) D158.2(A) D167.2(A) D176.2(A) D185.2(A) D194.2(A) D203.2(A) D212.2(A) Q4.3(D)
NetD150_2: D150.2(A) D159.2(A) D168.2(A) D177.2(A) D186.2(A) D195.2(A) D204.2(A) D213.2(A) Q5.3(D)
NetD151_2: D151.2(A) D160.2(A) D169.2(A) D178.2(A) D187.2(A) D196.2(A) D205.2(A) D214.2(A) Q6.3(D)
NetD152_2: D152.2(A) D161.2(A) D170.2(A) D179.2(A) D188.2(A) D197.2(A) D206.2(A) D215.2(A) Q7.3(D)
NetD153_2: D153.2(A) D162.2(A) D171.2(A) D180.2(A) D189.2(A) D198.2(A) D207.2(A) D216.2(A) Q8.3(D)
NetD154_2: D154.2(A) D163.2(A) D172.2(A) D181.2(A) D190.2(A) D199.2(A) D208.2(A) D217.2(A) Q9.3(D)
NetD155_2: D155.2(A) D164.2(A) D173.2(A) D182.2(A) D191.2(A) D200.2(A) D209.2(A) D218.2(A) Q10.3(D)
NetD156_2: D156.2(A) D165.2(A) D174.2(A) D183.2(A) D192.2(A) D201.2(A) D210.2(A) Q12.3(D)
NetD157_1: D157.1(R) D158.1(R) D159.1(R) D160.1(R) D161.1(R) D162.1(R) D163.1(R) D164.1(R) D165.1(R) U8.8(OUT3)
NetD157_3: D157.3(B) D158.3(B) D159.3(B) D160.3(B) D161.3(B) D162.3(B) D163.3(B) D164.3(B) D165.3(B) U8.9(OUT4)
NetD157_4: D157.4(G) D158.4(G) D159.4(G) D160.4(G) D161.4(G) D162.4(G) D163.4(G) D164.4(G) D165.4(G) U8.10(OUT5)
NetD166_1: D166.1(R) D167.1(R) D168.1(R) D169.1(R) D170.1(R) D171.1(R) D172.1(R) D173.1(R) D174.1(R) U8.11(OUT6)
NetD166_3: D166.3(B) D167.3(B) D168.3(B) D169.3(B) D170.3(B) D171.3(B) D172.3(B) D173.3(B) D174.3(B) U8.12(OUT7)
NetD166_4: D166.4(G) D167.4(G) D168.4(G) D169.4(G) D170.4(G) D171.4(G) D172.4(G) D173.4(G) D174.4(G) U8.13(OUT8)
NetD175_1: D175.1(R) D176.1(R) D177.1(R) D178.1(R) D179.1(R) D180.1(R) D181.1(R) D182.1(R) D183.1(R) U8.14(OUT9)
NetD175_3: D175.3(B) D176.3(B) D177.3(B) D178.3(B) D179.3(B) D180.3(B) D181.3(B) D182.3(B) D183.3(B) U8.15(OUT10)
NetD175_4: D175.4(G) D176.4(G) D177.4(G) D178.4(G) D179.4(G) D180.4(G) D181.4(G) D182.4(G) D183.4(G) U8.16(OUT11)
NetD184_1: D184.1(R) D185.1(R) D186.1(R) D187.1(R) D188.1(R) D189.1(R) D190.1(R) D191.1(R) D192.1(R) U9.5(OUT0)
NetD184_3: D184.3(B) D185.3(B) D186.3(B) D187.3(B) D188.3(B) D189.3(B) D190.3(B) D191.3(B) D192.3(B) U9.6(OUT1)
NetD184_4: D184.4(G) D185.4(G) D186.4(G) D187.4(G) D188.4(G) D189.4(G) D190.4(G) D191.4(G) D192.4(G) U9.7(OUT2)
NetD193_1: D193.1(R) D194.1(R) D195.1(R) D196.1(R) D197.1(R) D198.1(R) D199.1(R) D200.1(R) D201.1(R) U9.8(OUT3)
NetD193_3: D193.3(B) D194.3(B) D195.3(B) D196.3(B) D197.3(B) D198.3(B) D199.3(B) D200.3(B) D201.3(B) U9.9(OUT4)
NetD193_4: D193.4(G) D194.4(G) D195.4(G) D196.4(G) D197.4(G) D198.4(G) D199.4(G) D200.4(G) D201.4(G) U9.10(OUT5)
NetD202_1: D202.1(R) D203.1(R) D204.1(R) D205.1(R) D206.1(R) D207.1(R) D208.1(R) D209.1(R) D210.1(R) U9.11(OUT6)
NetD202_3: D202.3(B) D203.3(B) D204.3(B) D205.3(B) D206.3(B) D207.3(B) D208.3(B) D209.3(B) D210.3(B) U9.12(OUT7)
NetD202_4: D202.4(G) D203.4(G) D204.4(G) D205.4(G) D206.4(G) D207.4(G) D208.4(G) D209.4(G) D210.4(G) U9.13(OUT8)
NetD211_1: D211.1(R) D212.1(R) D213.1(R) D214.1(R) D215.1(R) D216.1(R) D217.1(R) D218.1(R) U9.14(OUT9)
NetD211_3: D211.3(B) D212.3(B) D213.3(B) D214.3(B) D215.3(B) D216.3(B) D217.3(B) D218.3(B) U9.15(OUT10)
NetD211_4: D211.4(G) D212.4(G) D213.4(G) D214.4(G) D215.4(G) D216.4(G) D217.4(G) D218.4(G) U9.16(OUT11)
NetQ3_1: Q3.1(G) R60.2 R75.1
NetQ4_1: Q4.1(G) R61.2 R62.2
NetQ5_1: Q5.1(G) R63.2 R64.2
NetQ6_1: Q6.1(G) R65.2 R66.2
NetQ7_1: Q7.1(G) R67.2 R68.2
NetQ8_1: Q8.1(G) R69.2 R70.2
NetQ9_1: Q9.1(G) R71.2 R72.2
NetQ10_1: Q10.1(G) R73.2 R74.2
NetQ12_1: Q12.1(G) R82.2 R83.2
NetR61_1: R61.1 U7.1(QB) ; port COL1
NetR63_1: R63.1 U7.2(QC) ; port COL2
NetR65_1: R65.1 U7.3(QD) ; port COL3
NetR67_1: R67.1 U7.4(QE) ; port COL4
NetR69_1: R69.1 U7.5(QF) ; port COL5
NetR71_1: R71.1 U7.6(QG) ; port COL6
NetR73_1: R73.1 U7.7(QH) ; port COL7
NetR75_2: R75.2 U7.15(QA) ; port COL0
NetR76_2: R76.2 U7.13(~{G}) ; port EN_LED_COL
NetR77_2: R77.2 U8.21(BLANK) U9.21(BLANK) ; port EN_LED_ROW
NetR78_2: R78.2 U8.23(Iref)
NetR79_2: R79.2 U9.23(Iref)
NetR82_1: R82.1 ; port COL_EXTRA
NetU5_36: U7.9(SDO) ; port SO_LED
NetU5_46: U9.2(SI) ; port SI_LED
NetU5_49: U7.12(RCLK) U8.3(SCLK) U9.4(LAT) ; port RCLK_LED
NetU5_50: U7.11(SRCLK) U8.4(LAT) U9.3(SCLK) ; port SCLK_LED
NetU7_14: U7.14(SDI) U8.22(SO)
NetU8_2: U8.2(SI) U9.22(SO)
NetU8_17: U8.17(OUT12) ; port led_plus0
NetU8_18: U8.18(OUT13) ; port led_plus1
NetU8_19: U8.19(OUT14) ; port led_plus2
NetU8_20: U8.20(OUT15) ; port led_plus3

Not connected (* = marked no-connect by the designer): U9 17(OUT12)* 18(OUT13)* 19(OUT14)* 20(OUT15)*

### Layout directives
net class leds: (no net found under the mark)
net class sipo: (no net found under the mark), NetU5_36

### Notes on the sheet
- Title:
- File:
- asterix24@gmail.com
- Ing. Daniele Basile
- Rev:
- Date:
- Time:
- Sheet
- of

### Library data of the parts
C50 = C: CER 50V X7R
C51 C52 = Cap: Ceramic X7R 50V; Value: 10nF; Published: 8-Jun-2000; Revision: July-2002: Re-released for DXP Platform.; Publisher: Altium Limited
D148-D218 = Led_RGB_COM_A_THD: Led RGB Thrue Hole
Q3 = MOSFET-P 3pin: IRLML5103TRPbF; DMG1013UW;
Q4-Q10 Q12 = MOSFET-P 3pin
R60 R62 R64 R66 R68 R70 R72 R74 R76-R79 R83 = Res1: Resistor; Value: 1K; Published: 8-Jun-2000; Revision: July-2002: Re-released for DXP Platform.; Publisher: Altium Limited
R61 R63 R65 R67 R69 R71 R73 R75 R82 = Res1: Resistor; Published: 8-Jun-2000; Revision: July-2002: Re-released for DXP Platform.; Publisher: Altium Limited; Value: 1K
U7 = 74HC595_27: 8-Bit Serial-Input/Serial or Prallel-Output Shift Register with Latched 3-State Outputs
U8 U9 = Led_driver: (Texas TLC5928; ST STP16CP05)

## Sheet keymap.SchDoc
size A3; Organization: Develer s.r.l.; Address1: via Mugellese 1/A; Address2: 50019 Campi Bisenzio; Address3: Firenze; Address4: ITALY; Revision: A; SheetNumber: 1; SheetTotal: 1
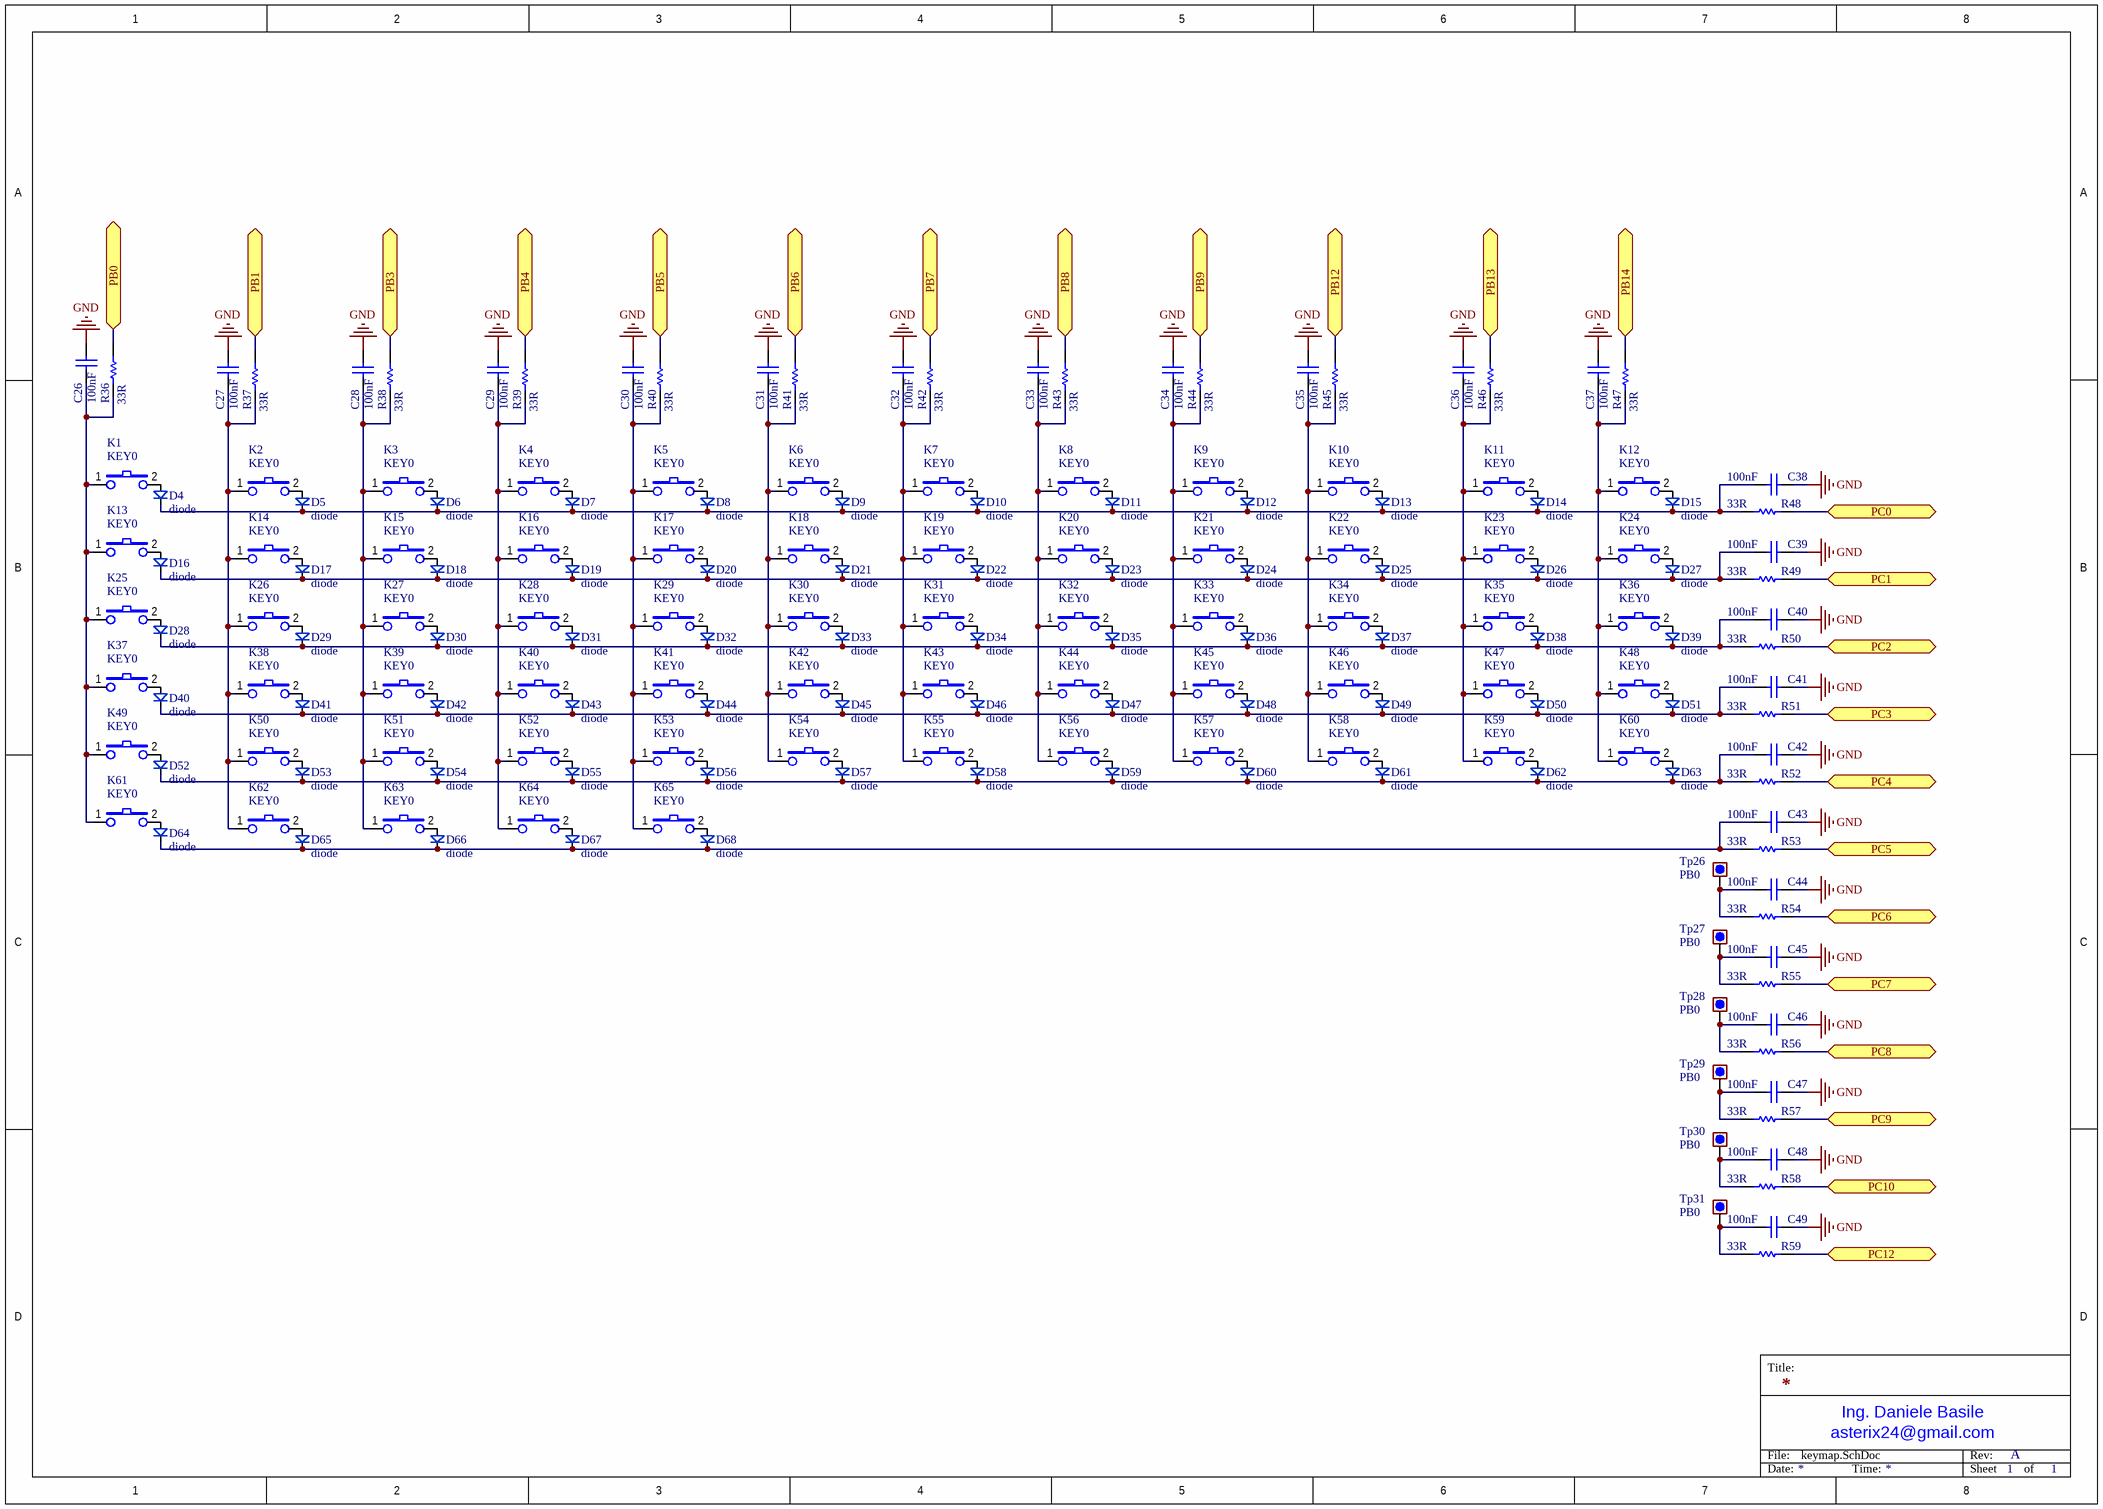
[diagram p3: keymap.SchDoc]

### Parts
C26  100nF  [0603_[1608]]
C27  100nF  [0603_[1608]]
C28  100nF  [0603_[1608]]
C29  100nF  [0603_[1608]]
C30  100nF  [0603_[1608]]
C31  100nF  [0603_[1608]]
C32  100nF  [0603_[1608]]
C33  100nF  [0603_[1608]]
C34  100nF  [0603_[1608]]
C35  100nF  [0603_[1608]]
C36  100nF  [0603_[1608]]
C37  100nF  [0603_[1608]]
C38  100nF  [0603_[1608]]
C39  100nF  [0603_[1608]]
C40  100nF  [0603_[1608]]
C41  100nF  [0603_[1608]]
C42  100nF  [0603_[1608]]
C43  100nF  [0603_[1608]]
C44  100nF  [0603_[1608]]
C45  100nF  [0603_[1608]]
C46  100nF  [0603_[1608]]
C47  100nF  [0603_[1608]]
C48  100nF  [0603_[1608]]
C49  100nF  [0603_[1608]]
D4  diode  [SOD-123]
D5  diode  [SOD-123]
D6  diode  [SOD-123]
D7  diode  [SOD-123]
D8  diode  [SOD-123]
D9  diode  [SOD-123]
D10  diode  [SOD-123]
D11  diode  [SOD-123]
D12  diode  [SOD-123]
D13  diode  [SOD-123]
D14  diode  [SOD-123]
D15  diode  [SOD-123]
D16  diode  [SOD-123]
D17  diode  [SOD-123]
D18  diode  [SOD-123]
D19  diode  [SOD-123]
D20  diode  [SOD-123]
D21  diode  [SOD-123]
D22  diode  [SOD-123]
D23  diode  [SOD-123]
D24  diode  [SOD-123]
D25  diode  [SOD-123]
D26  diode  [SOD-123]
D27  diode  [SOD-123]
D28  diode  [SOD-123]
D29  diode  [SOD-123]
D30  diode  [SOD-123]
D31  diode  [SOD-123]
D32  diode  [SOD-123]
D33  diode  [SOD-123]
D34  diode  [SOD-123]
D35  diode  [SOD-123]
D36  diode  [SOD-123]
D37  diode  [SOD-123]
D38  diode  [SOD-123]
D39  diode  [SOD-123]
D40  diode  [SOD-123]
D41  diode  [SOD-123]
D42  diode  [SOD-123]
D43  diode  [SOD-123]
D44  diode  [SOD-123]
D45  diode  [SOD-123]
D46  diode  [SOD-123]
D47  diode  [SOD-123]
D48  diode  [SOD-123]
D49  diode  [SOD-123]
D50  diode  [SOD-123]
D51  diode  [SOD-123]
D52  diode  [SOD-123]
D53  diode  [SOD-123]
D54  diode  [SOD-123]
D55  diode  [SOD-123]
D56  diode  [SOD-123]
D57  diode  [SOD-123]
D58  diode  [SOD-123]
D59  diode  [SOD-123]
D60  diode  [SOD-123]
D61  diode  [SOD-123]
D62  diode  [SOD-123]
D63  diode  [SOD-123]
D64  diode  [SOD-123]
D65  diode  [SOD-123]
D66  diode  [SOD-123]
D67  diode  [SOD-123]
D68  diode  [SOD-123]
K1  KEY0  [tactile_switch_gateron_pcb]
K2  KEY0  [tactile_switch_gateron_pcb]
K3  KEY0  [tactile_switch_gateron_pcb]
K4  KEY0  [tactile_switch_gateron_pcb]
K5  KEY0  [tactile_switch_gateron_pcb]
K6  KEY0  [tactile_switch_gateron_pcb]
K7  KEY0  [tactile_switch_gateron_pcb]
K8  KEY0  [tactile_switch_gateron_pcb]
K9  KEY0  [tactile_switch_gateron_pcb]
K10  KEY0  [tactile_switch_gateron_pcb]
K11  KEY0  [tactile_switch_gateron_pcb]
K12  KEY0  [tactile_switch_gateron_pcb]
K13  KEY0  [tactile_switch_gateron_pcb]
K14  KEY0  [tactile_switch_gateron_pcb]
K15  KEY0  [tactile_switch_gateron_pcb]
K16  KEY0  [tactile_switch_gateron_pcb]
K17  KEY0  [tactile_switch_gateron_pcb]
K18  KEY0  [tactile_switch_gateron_pcb]
K19  KEY0  [tactile_switch_gateron_pcb]
K20  KEY0  [tactile_switch_gateron_pcb]
K21  KEY0  [tactile_switch_gateron_pcb]
K22  KEY0  [tactile_switch_gateron_pcb]
K23  KEY0  [tactile_switch_gateron_pcb]
K24  KEY0  [tactile_switch_gateron_pcb]
K25  KEY0  [tactile_switch_gateron_pcb]
K26  KEY0  [tactile_switch_gateron_pcb]
K27  KEY0  [tactile_switch_gateron_pcb]
K28  KEY0  [tactile_switch_gateron_pcb]
K29  KEY0  [tactile_switch_gateron_pcb]
K30  KEY0  [tactile_switch_gateron_pcb]
K31  KEY0  [tactile_switch_gateron_pcb]
K32  KEY0  [tactile_switch_gateron_pcb]
K33  KEY0  [tactile_switch_gateron_pcb]
K34  KEY0  [tactile_switch_gateron_pcb]
K35  KEY0  [tactile_switch_gateron_pcb]
K36  KEY0  [tactile_switch_gateron_pcb]
K37  KEY0  [tactile_switch_gateron_pcb]
K38  KEY0  [tactile_switch_gateron_pcb]
K39  KEY0  [tactile_switch_gateron_pcb]
K40  KEY0  [tactile_switch_gateron_pcb]
K41  KEY0  [tactile_switch_gateron_pcb]
K42  KEY0  [tactile_switch_gateron_pcb]
K43  KEY0  [tactile_switch_gateron_pcb]
K44  KEY0  [tactile_switch_gateron_pcb]
K45  KEY0  [tactile_switch_gateron_pcb]
K46  KEY0  [tactile_switch_gateron_pcb]
K47  KEY0  [tactile_switch_gateron_pcb]
K48  KEY0  [tactile_switch_gateron_pcb]
K49  KEY0  [tactile_switch_gateron_pcb]
K50  KEY0  [tactile_switch_gateron_pcb]
K51  KEY0  [tactile_switch_gateron_pcb]
K52  KEY0  [tactile_switch_gateron_pcb]
K53  KEY0  [tactile_switch_gateron_pcb]
K54  KEY0  [tactile_switch_gateron_pcb]
K55  KEY0  [tactile_switch_gateron_pcb]
K56  KEY0  [tactile_switch_gateron_pcb]
K57  KEY0  [tactile_switch_gateron_pcb]
K58  KEY0  [tactile_switch_gateron_pcb]
K59  KEY0  [tactile_switch_gateron_pcb]
K60  KEY0  [tactile_switch_gateron_pcb]
K61  KEY0  [tactile_switch_gateron_pcb]
K62  KEY0  [tactile_switch_gateron_pcb]
K63  KEY0  [tactile_switch_gateron_pcb]
K64  KEY0  [tactile_switch_gateron_pcb]
K65  KEY0  [tactile_switch_gateron_pcb]
R36  33R  [0603_[1608]]
R37  33R  [0603_[1608]]
R38  33R  [0603_[1608]]
R39  33R  [0603_[1608]]
R40  33R  [0603_[1608]]
R41  33R  [0603_[1608]]
R42  33R  [0603_[1608]]
R43  33R  [0603_[1608]]
R44  33R  [0603_[1608]]
R45  33R  [0603_[1608]]
R46  33R  [0603_[1608]]
R47  33R  [0603_[1608]]
R48  33R  [0603_[1608]]
R49  33R  [0603_[1608]]
R50  33R  [0603_[1608]]
R51  33R  [0603_[1608]]
R52  33R  [0603_[1608]]
R53  33R  [0603_[1608]]
R54  33R  [0603_[1608]]
R55  33R  [0603_[1608]]
R56  33R  [0603_[1608]]
R57  33R  [0603_[1608]]
R58  33R  [0603_[1608]]
R59  33R  [0603_[1608]]
Tp26  PB0  [TEST_POINT_THD_D1.8MM]  (no BOM)
Tp27  PB0  [TEST_POINT_THD_D1.8MM]  (no BOM)
Tp28  PB0  [TEST_POINT_THD_D1.8MM]  (no BOM)
Tp29  PB0  [TEST_POINT_THD_D1.8MM]  (no BOM)
Tp30  PB0  [TEST_POINT_THD_D1.8MM]  (no BOM)
Tp31  PB0  [TEST_POINT_THD_D1.8MM]  (no BOM)

### Ports
PB0, PB1, PB3, PB4, PB5, PB6, PB7, PB8, PB9, PB12, PB13, PB14, PC0, PC1, PC2, PC3, PC4, PC5, PC6, PC7, PC8, PC9, PC10, PC12

### Nets
GND: C26.2 C27.2 C28.2 C29.2 C30.2 C31.2 C32.2 C33.2 C34.2 C35.2 C36.2 C37.2 C38.2 C39.2 C40.2 C41.2 C42.2 C43.2 C44.2 C45.2 C46.2 C47.2 C48.2 C49.2
NetC26_1: C26.1 K1.1 K13.1 K25.1 K37.1 K49.1 K61.1 R36.1
NetC27_1: C27.1 K2.1 K14.1 K26.1 K38.1 K50.1 K62.1 R37.1
NetC28_1: C28.1 K3.1 K15.1 K27.1 K39.1 K51.1 K63.1 R38.1
NetC29_1: C29.1 K4.1 K16.1 K28.1 K40.1 K52.1 K64.1 R39.1
NetC30_1: C30.1 K5.1 K17.1 K29.1 K41.1 K53.1 K65.1 R40.1
NetC31_1: C31.1 K6.1 K18.1 K30.1 K42.1 K54.1 R41.1
NetC32_1: C32.1 K7.1 K19.1 K31.1 K43.1 K55.1 R42.1
NetC33_1: C33.1 K8.1 K20.1 K32.1 K44.1 K56.1 R43.1
NetC34_1: C34.1 K9.1 K21.1 K33.1 K45.1 K57.1 R44.1
NetC35_1: C35.1 K10.1 K22.1 K34.1 K46.1 K58.1 R45.1
NetC36_1: C36.1 K11.1 K23.1 K35.1 K47.1 K59.1 R46.1
NetC37_1: C37.1 K12.1 K24.1 K36.1 K48.1 K60.1 R47.1
NetC38_1: C38.1 D4.1(K) D5.1(K) D6.1(K) D7.1(K) D8.1(K) D9.1(K) D10.1(K) D11.1(K) D12.1(K) D13.1(K) D14.1(K) D15.1(K) R48.1
NetC39_1: C39.1 D16.1(K) D17.1(K) D18.1(K) D19.1(K) D20.1(K) D21.1(K) D22.1(K) D23.1(K) D24.1(K) D25.1(K) D26.1(K) D27.1(K) R49.1
NetC40_1: C40.1 D28.1(K) D29.1(K) D30.1(K) D31.1(K) D32.1(K) D33.1(K) D34.1(K) D35.1(K) D36.1(K) D37.1(K) D38.1(K) D39.1(K) R50.1
NetC41_1: C41.1 D40.1(K) D41.1(K) D42.1(K) D43.1(K) D44.1(K) D45.1(K) D46.1(K) D47.1(K) D48.1(K) D49.1(K) D50.1(K) D51.1(K) R51.1
NetC42_1: C42.1 D52.1(K) D53.1(K) D54.1(K) D55.1(K) D56.1(K) D57.1(K) D58.1(K) D59.1(K) D60.1(K) D61.1(K) D62.1(K) D63.1(K) R52.1
NetC43_1: C43.1 D64.1(K) D65.1(K) D66.1(K) D67.1(K) D68.1(K) R53.1
NetC44_1: C44.1 R54.1 Tp26.1
NetC45_1: C45.1 R55.1 Tp27.1
NetC46_1: C46.1 R56.1 Tp28.1
NetC47_1: C47.1 R57.1 Tp29.1
NetC48_1: C48.1 R58.1 Tp30.1
NetC49_1: C49.1 R59.1 Tp31.1
NetD4_2: D4.2(A) K1.2
NetD5_2: D5.2(A) K2.2
NetD6_2: D6.2(A) K3.2
NetD7_2: D7.2(A) K4.2
NetD8_2: D8.2(A) K5.2
NetD9_2: D9.2(A) K6.2
NetD10_2: D10.2(A) K7.2
NetD11_2: D11.2(A) K8.2
NetD12_2: D12.2(A) K9.2
NetD13_2: D13.2(A) K10.2
NetD14_2: D14.2(A) K11.2
NetD15_2: D15.2(A) K12.2
NetD16_2: D16.2(A) K13.2
NetD17_2: D17.2(A) K14.2
NetD18_2: D18.2(A) K15.2
NetD19_2: D19.2(A) K16.2
NetD20_2: D20.2(A) K17.2
NetD21_2: D21.2(A) K18.2
NetD22_2: D22.2(A) K19.2
NetD23_2: D23.2(A) K20.2
NetD24_2: D24.2(A) K21.2
NetD25_2: D25.2(A) K22.2
NetD26_2: D26.2(A) K23.2
NetD27_2: D27.2(A) K24.2
NetD28_2: D28.2(A) K25.2
NetD29_2: D29.2(A) K26.2
NetD30_2: D30.2(A) K27.2
NetD31_2: D31.2(A) K28.2
NetD32_2: D32.2(A) K29.2
NetD33_2: D33.2(A) K30.2
NetD34_2: D34.2(A) K31.2
NetD35_2: D35.2(A) K32.2
NetD36_2: D36.2(A) K33.2
NetD37_2: D37.2(A) K34.2
NetD38_2: D38.2(A) K35.2
NetD39_2: D39.2(A) K36.2
NetD40_2: D40.2(A) K37.2
NetD41_2: D41.2(A) K38.2
NetD42_2: D42.2(A) K39.2
NetD43_2: D43.2(A) K40.2
NetD44_2: D44.2(A) K41.2
NetD45_2: D45.2(A) K42.2
NetD46_2: D46.2(A) K43.2
NetD47_2: D47.2(A) K44.2
NetD48_2: D48.2(A) K45.2
NetD49_2: D49.2(A) K46.2
NetD50_2: D50.2(A) K47.2
NetD51_2: D51.2(A) K48.2
NetD52_2: D52.2(A) K49.2
NetD53_2: D53.2(A) K50.2
NetD54_2: D54.2(A) K51.2
NetD55_2: D55.2(A) K52.2
NetD56_2: D56.2(A) K53.2
NetD57_2: D57.2(A) K54.2
NetD58_2: D58.2(A) K55.2
NetD59_2: D59.2(A) K56.2
NetD60_2: D60.2(A) K57.2
NetD61_2: D61.2(A) K58.2
NetD62_2: D62.2(A) K59.2
NetD63_2: D63.2(A) K60.2
NetD64_2: D64.2(A) K61.2
NetD65_2: D65.2(A) K62.2
NetD66_2: D66.2(A) K63.2
NetD67_2: D67.2(A) K64.2
NetD68_2: D68.2(A) K65.2
NetR36_2: R36.2 ; port PB0
NetR37_2: R37.2 ; port PB1
NetR38_2: R38.2 ; port PB3
NetR39_2: R39.2 ; port PB4
NetR40_2: R40.2 ; port PB5
NetR41_2: R41.2 ; port PB6
NetR42_2: R42.2 ; port PB7
NetR43_2: R43.2 ; port PB8
NetR44_2: R44.2 ; port PB9
NetR45_2: R45.2 ; port PB12
NetR46_2: R46.2 ; port PB13
NetR47_2: R47.2 ; port PB14
NetR48_2: R48.2 ; port PC0
NetR49_2: R49.2 ; port PC1
NetR50_2: R50.2 ; port PC2
NetR51_2: R51.2 ; port PC3
NetR52_2: R52.2 ; port PC4
NetR53_2: R53.2 ; port PC5
NetR54_2: R54.2 ; port PC6
NetR55_2: R55.2 ; port PC7
NetR56_2: R56.2 ; port PC8
NetR57_2: R57.2 ; port PC9
NetR58_2: R58.2 ; port PC10
NetR59_2: R59.2 ; port PC12

Not connected (* = marked no-connect by the designer): K1 3(GND) 4(GND); K2 3(GND) 4(GND); K3 3(GND) 4(GND); K4 3(GND) 4(GND); K5 3(GND) 4(GND); K6 3(GND) 4(GND); K7 3(GND) 4(GND); K8 3(GND) 4(GND); K9 3(GND) 4(GND); K10 3(GND) 4(GND); K11 3(GND) 4(GND); K12 3(GND) 4(GND); K13 3(GND) 4(GND); K14 3(GND) 4(GND); K15 3(GND) 4(GND); K16 3(GND) 4(GND); K17 3(GND) 4(GND); K18 3(GND) 4(GND); K19 3(GND) 4(GND); K20 3(GND) 4(GND); K21 3(GND) 4(GND); K22 3(GND) 4(GND); K23 3(GND) 4(GND); K24 3(GND) 4(GND); K25 3(GND) 4(GND); K26 3(GND) 4(GND); K27 3(GND) 4(GND); K28 3(GND) 4(GND); K29 3(GND) 4(GND); K30 3(GND) 4(GND); K31 3(GND) 4(GND); K32 3(GND) 4(GND); K33 3(GND) 4(GND); K34 3(GND) 4(GND); K35 3(GND) 4(GND); K36 3(GND) 4(GND); K37 3(GND) 4(GND); K38 3(GND) 4(GND); K39 3(GND) 4(GND); K40 3(GND) 4(GND); K41 3(GND) 4(GND); K42 3(GND) 4(GND); K43 3(GND) 4(GND); K44 3(GND) 4(GND); K45 3(GND) 4(GND); K46 3(GND) 4(GND); K47 3(GND) 4(GND); K48 3(GND) 4(GND); K49 3(GND) 4(GND); K50 3(GND) 4(GND); K51 3(GND) 4(GND); K52 3(GND) 4(GND); K53 3(GND) 4(GND); K54 3(GND) 4(GND); K55 3(GND) 4(GND); K56 3(GND) 4(GND); K57 3(GND) 4(GND); K58 3(GND) 4(GND); K59 3(GND) 4(GND); K60 3(GND) 4(GND); K61 3(GND) 4(GND); K62 3(GND) 4(GND); K63 3(GND) 4(GND); K64 3(GND) 4(GND); K65 3(GND) 4(GND)

### Notes on the sheet
- Title:
- File:
- asterix24@gmail.com
- Ing. Daniele Basile
- Rev:
- Date:
- Time:
- Sheet
- of

### Library data of the parts
C26-C49 = Cap: Ceramic X7R 50V; Value: 10nF; Published: 8-Jun-2000; Revision: July-2002: Re-released for DXP Platform.; Publisher: Altium Limited
D4-D68 = diode_small: Diode Schottky  low Vf, If 1A (PMEG3010ER; MBRX120LF)
K1-K65 = SWITCH-RA: Tactile Switch Right Angle 6x6; Part Number: Tyco FSMRA2JH; Purchase Code: RS 479-1520
R36-R59 = Res1: Resistor; Value: 1K; Published: 8-Jun-2000; Revision: July-2002: Re-released for DXP Platform.; Publisher: Altium Limited
Tp26-Tp31 = Test_point: Test point

## Nets that join several sheets
+3.3V: connectors (Q1.3 R2.1), cpu (7 pins), led (8 pins)
+5V: connectors (11 pins), cpu (5 pins), led (18 pins)
GND: connectors (29 pins), cpu (32 pins), led (11 pins), keymap (24 pins)
VCC_USB: connectors (7 pins), cpu (Tp7.1)
NetJ4_1: connectors (J4.1), cpu (R25.2 R30.1)
NetJ4_2: connectors (J4.2), cpu (R27.2 R31.1)
NetJ4_3: connectors (J4.3), cpu (R24.2 U5.60)
NetJ4_4: connectors (J4.4), cpu (R23.2 U5.7)
NetR5_2: connectors (R5.2), cpu (U5.52)
NetR12_2: connectors (U3.2), cpu (R12.2 R30.2)
NetR13_2: connectors (U3.30), cpu (R13.2 R31.2)
NetR16_2: connectors (R16.2), cpu (U5.14)
NetR17_2: connectors (R17.2), cpu (U5.15)
NetR18_2: connectors (R18.2), cpu (U5.20)
NetR19_2: connectors (R19.2), cpu (U5.21)
NetR20_2: connectors (R20.2), cpu (U5.22)
NetR21_2: connectors (R21.2), cpu (U5.23)
NetR36_2: cpu (U5.26), keymap (R36.2)
NetR37_2: cpu (U5.27), keymap (R37.2)
NetR38_2: cpu (U5.55), keymap (R38.2)
NetR39_2: cpu (U5.56), keymap (R39.2)
NetR40_2: cpu (U5.57), keymap (R40.2)
NetR41_2: cpu (U5.58), keymap (R41.2)
NetR42_2: cpu (U5.59), keymap (R42.2)
NetR43_2: cpu (U5.61), keymap (R43.2)
NetR44_2: cpu (U5.62), keymap (R44.2)
NetR45_2: cpu (U5.33), keymap (R45.2)
NetR46_2: cpu (U5.34), keymap (R46.2)
NetR47_2: cpu (U5.35), keymap (R47.2)
NetR48_2: cpu (U5.8), keymap (R48.2)
NetR49_2: cpu (U5.9), keymap (R49.2)
NetR50_2: cpu (U5.10), keymap (R50.2)
NetR51_2: cpu (U5.11), keymap (R51.2)
NetR52_2: cpu (U5.24), keymap (R52.2)
NetR53_2: cpu (U5.25), keymap (R53.2)
NetR54_2: cpu (U5.37), keymap (R54.2)
NetR55_2: cpu (U5.38), keymap (R55.2)
NetR56_2: cpu (U5.39), keymap (R56.2)
NetR57_2: cpu (U5.40), keymap (R57.2)
NetR58_2: cpu (U5.51), keymap (R58.2)
NetR59_2: cpu (U5.53), keymap (R59.2)
NetR76_2: cpu (U5.3), led (R76.2 U7.13)
NetR77_2: cpu (U5.4), led (R77.2 U8.21 U9.21)
NetR80_2: connectors (R80.2), cpu (U5.41)
NetR82_1: cpu (U5.2), led (R82.1)
NetU5_36: cpu (U5.36), led (U7.9)
NetU5_46: cpu (U5.46), led (U9.2)
NetU5_49: cpu (U5.49), led (U7.12 U8.3 U9.4)
NetU5_50: cpu (U5.50), led (U7.11 U8.4 U9.3)
usb_n: connectors (J1.2 U2.1 U2.6), cpu (U5.44)
usb_p: connectors (J1.3 R7.2 U2.3 U2.4), cpu (U5.45)